# EasyEDA Pro project SCH_and_PCB.epro, schematic 电磁感应aht
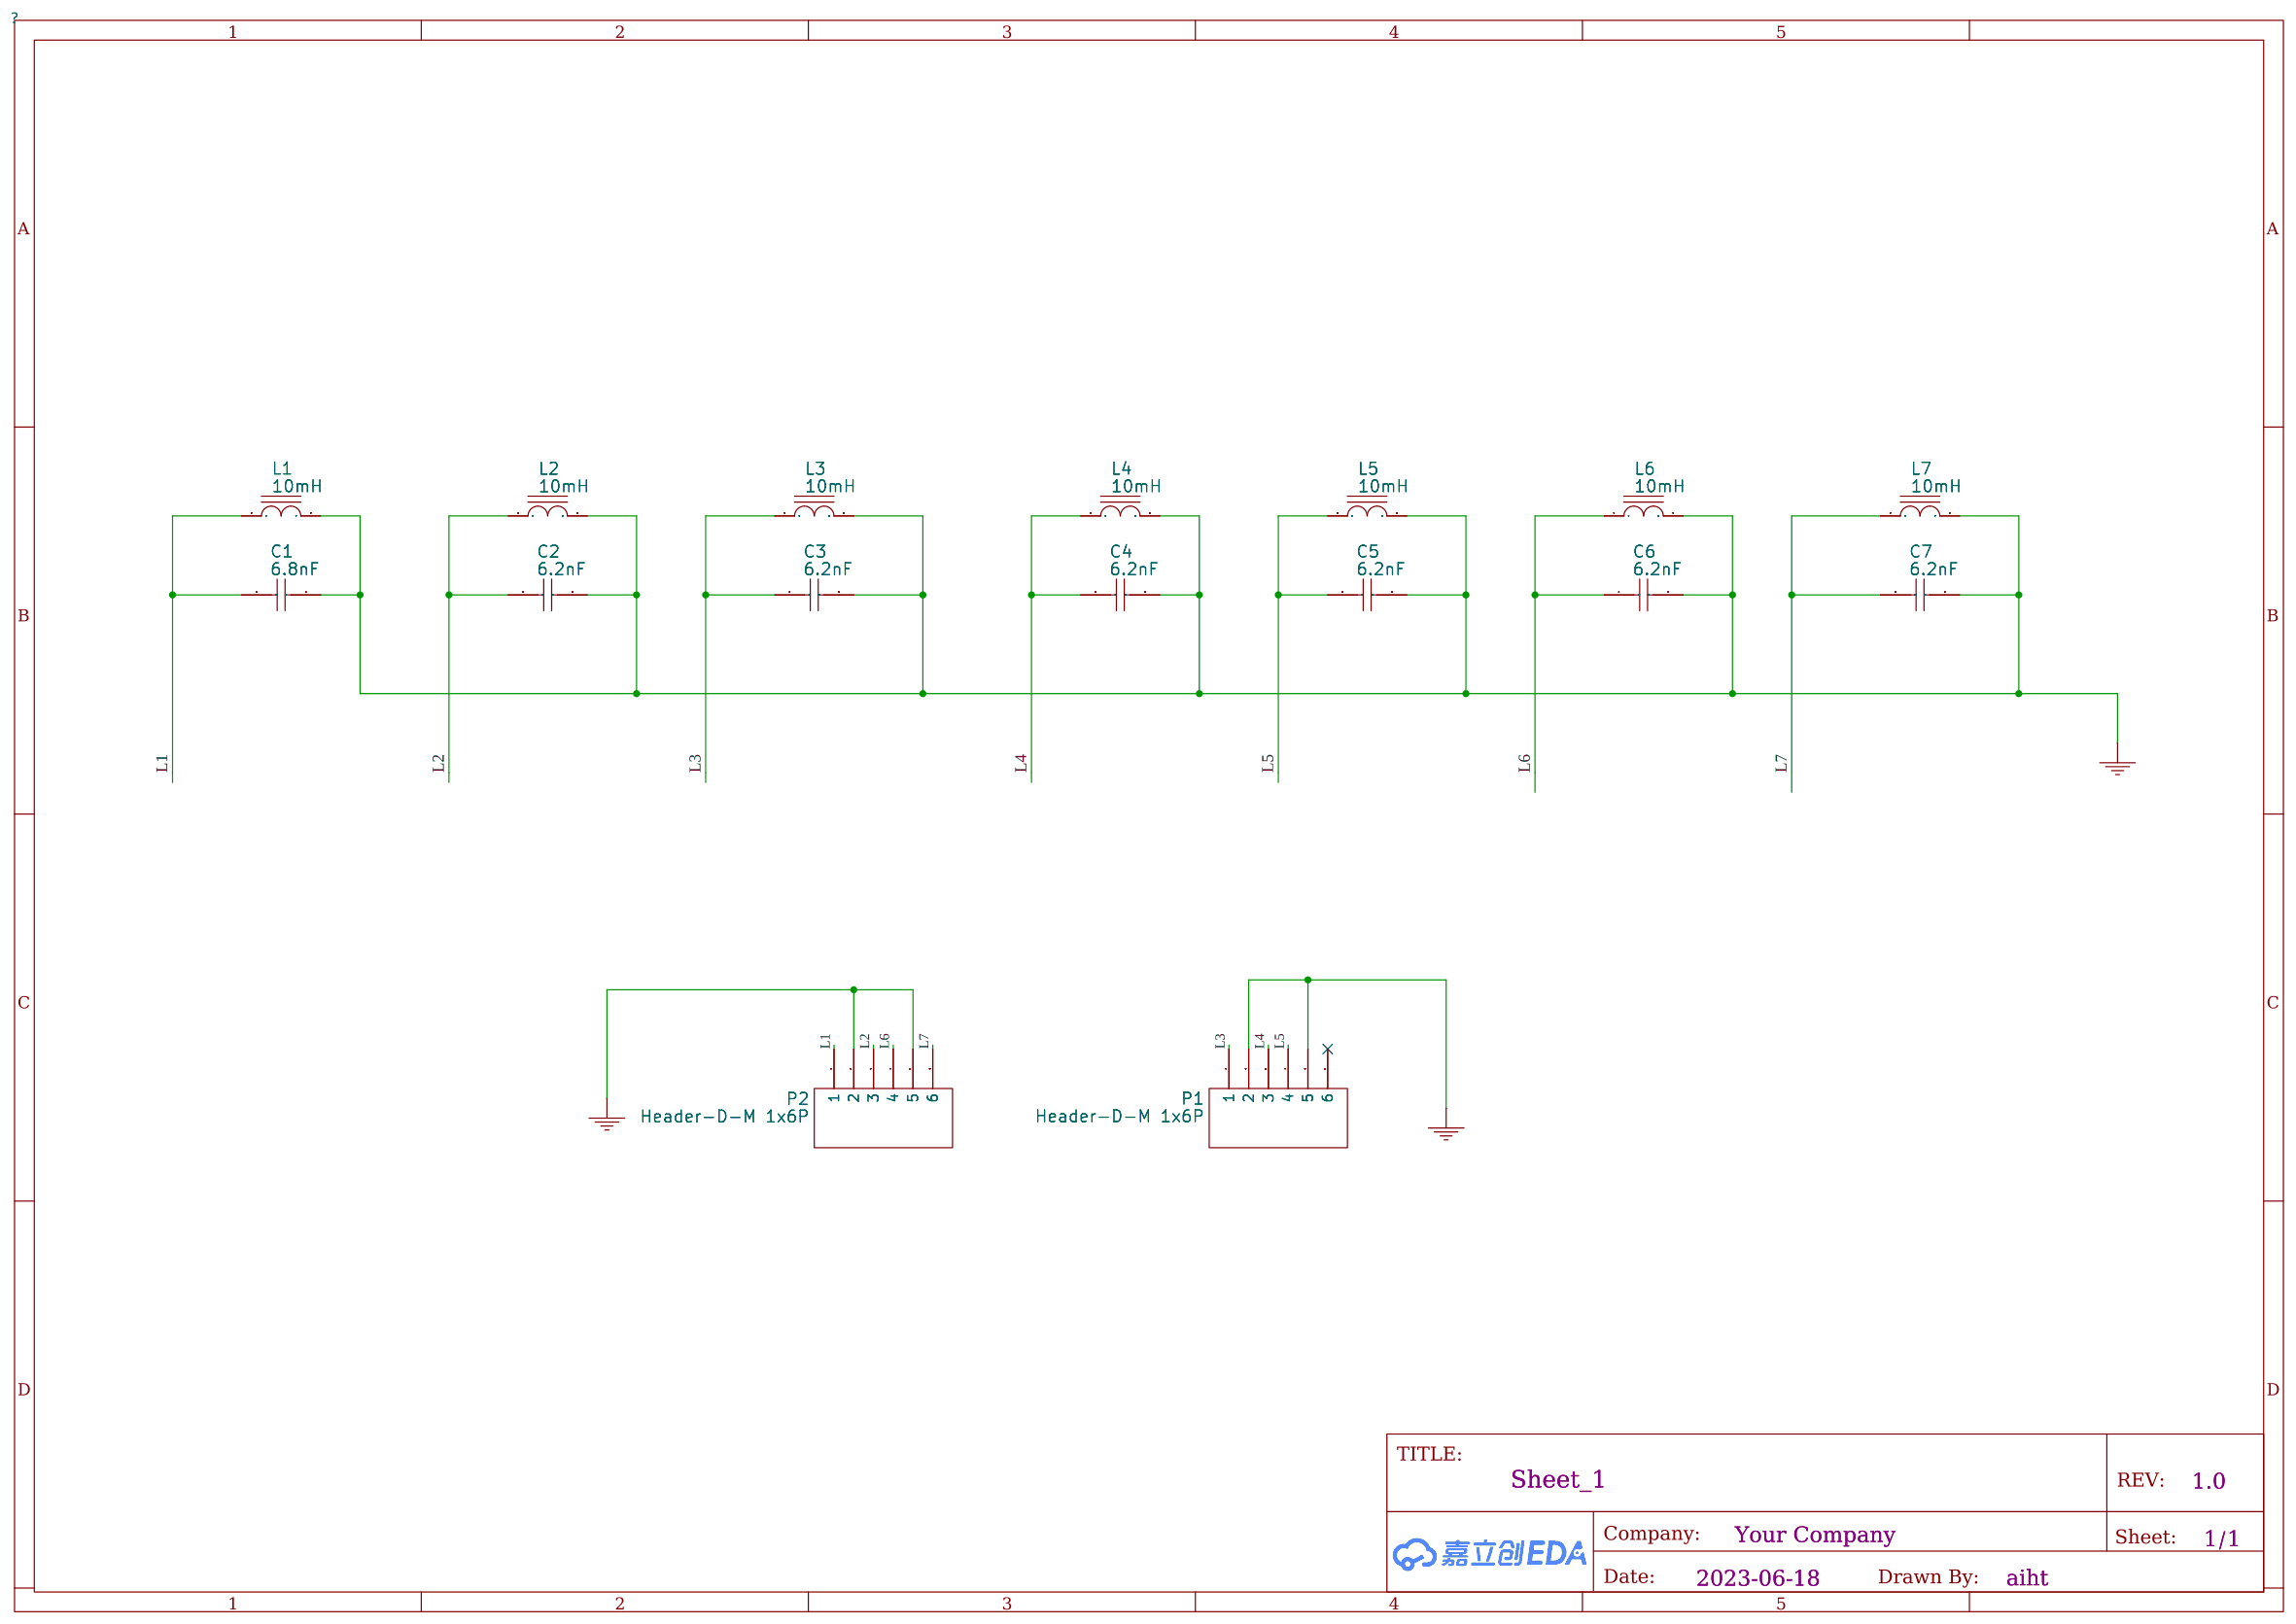
[diagram p4: schematic sheet]

## Parts
C1  6.8nF  [C0805]
C2  6.2nF  [C0805]
C3  6.2nF  [C0805]
C4  6.2nF  [C0805]
C5  6.2nF  [C0805]
C6  6.2nF  [C0805]
C7  6.2nF  [C0805]
L1  10mH  [卧式工字电感8*10]
L2  10mH  [卧式工字电感8*10]
L3  10mH  [卧式工字电感8*10]
L4  10mH  [卧式工字电感8*10]
L5  10mH  [卧式工字电感8*10]
L6  10mH  [卧式工字电感8*10]
L7  10mH  [卧式工字电感8*10]
P1  Header-D-M 1x6P  [HDR1X6-M]
P2  Header-D-M 1x6P  [HDR1X6-M]

## Library data of the parts
C1 = 6.8nF: link: https://item.szlcsc.com/373011.html; 3DModel: C0805_L2.0-W1.3-H1.3; Manufacturer: 汤姆逊TPC; Manufacturer Part: 682J100V
C2-C7 = 6.2nF: link: https://item.szlcsc.com/373011.html; 3DModel: C0805_L2.0-W1.3-H1.3; Manufacturer: 汤姆逊TPC; Manufacturer Part: 682J100V
L1-L7 = 10mH: Published: 8-Jun-2000; Revision: July-2002: Re-released for DXP Platform.; Publisher: Altium Limited; Imax: 50mA; DCR: .5m; Price(RMB): 0.000; Comment: 3.3uH
P1 P2 = Header-D-M 1x6P: Revision: V1.0

## Nets
GND: C1.2 C2.2 C3.2 C4.2 C5.2 C6.2 C7.2 L1.2 L2.2 L3.2 L4.2 L5.2 L6.2 L7.2 P1.2 P1.5 P2.2 P2.5
L1: C1.1 L1.1 P2.1
L2: C2.1 L2.1 P2.3
L3: C3.1 L3.1 P1.1
L4: C4.1 L4.1 P1.3
L5: C5.1 L5.1 P1.4
L6: C6.1 L6.1 P2.4
L7: C7.1 L7.1 P2.6

Not connected (* = marked no-connect by the designer): P1 6*
